# EAGLE schematic microelf (EAGLE 4.11)
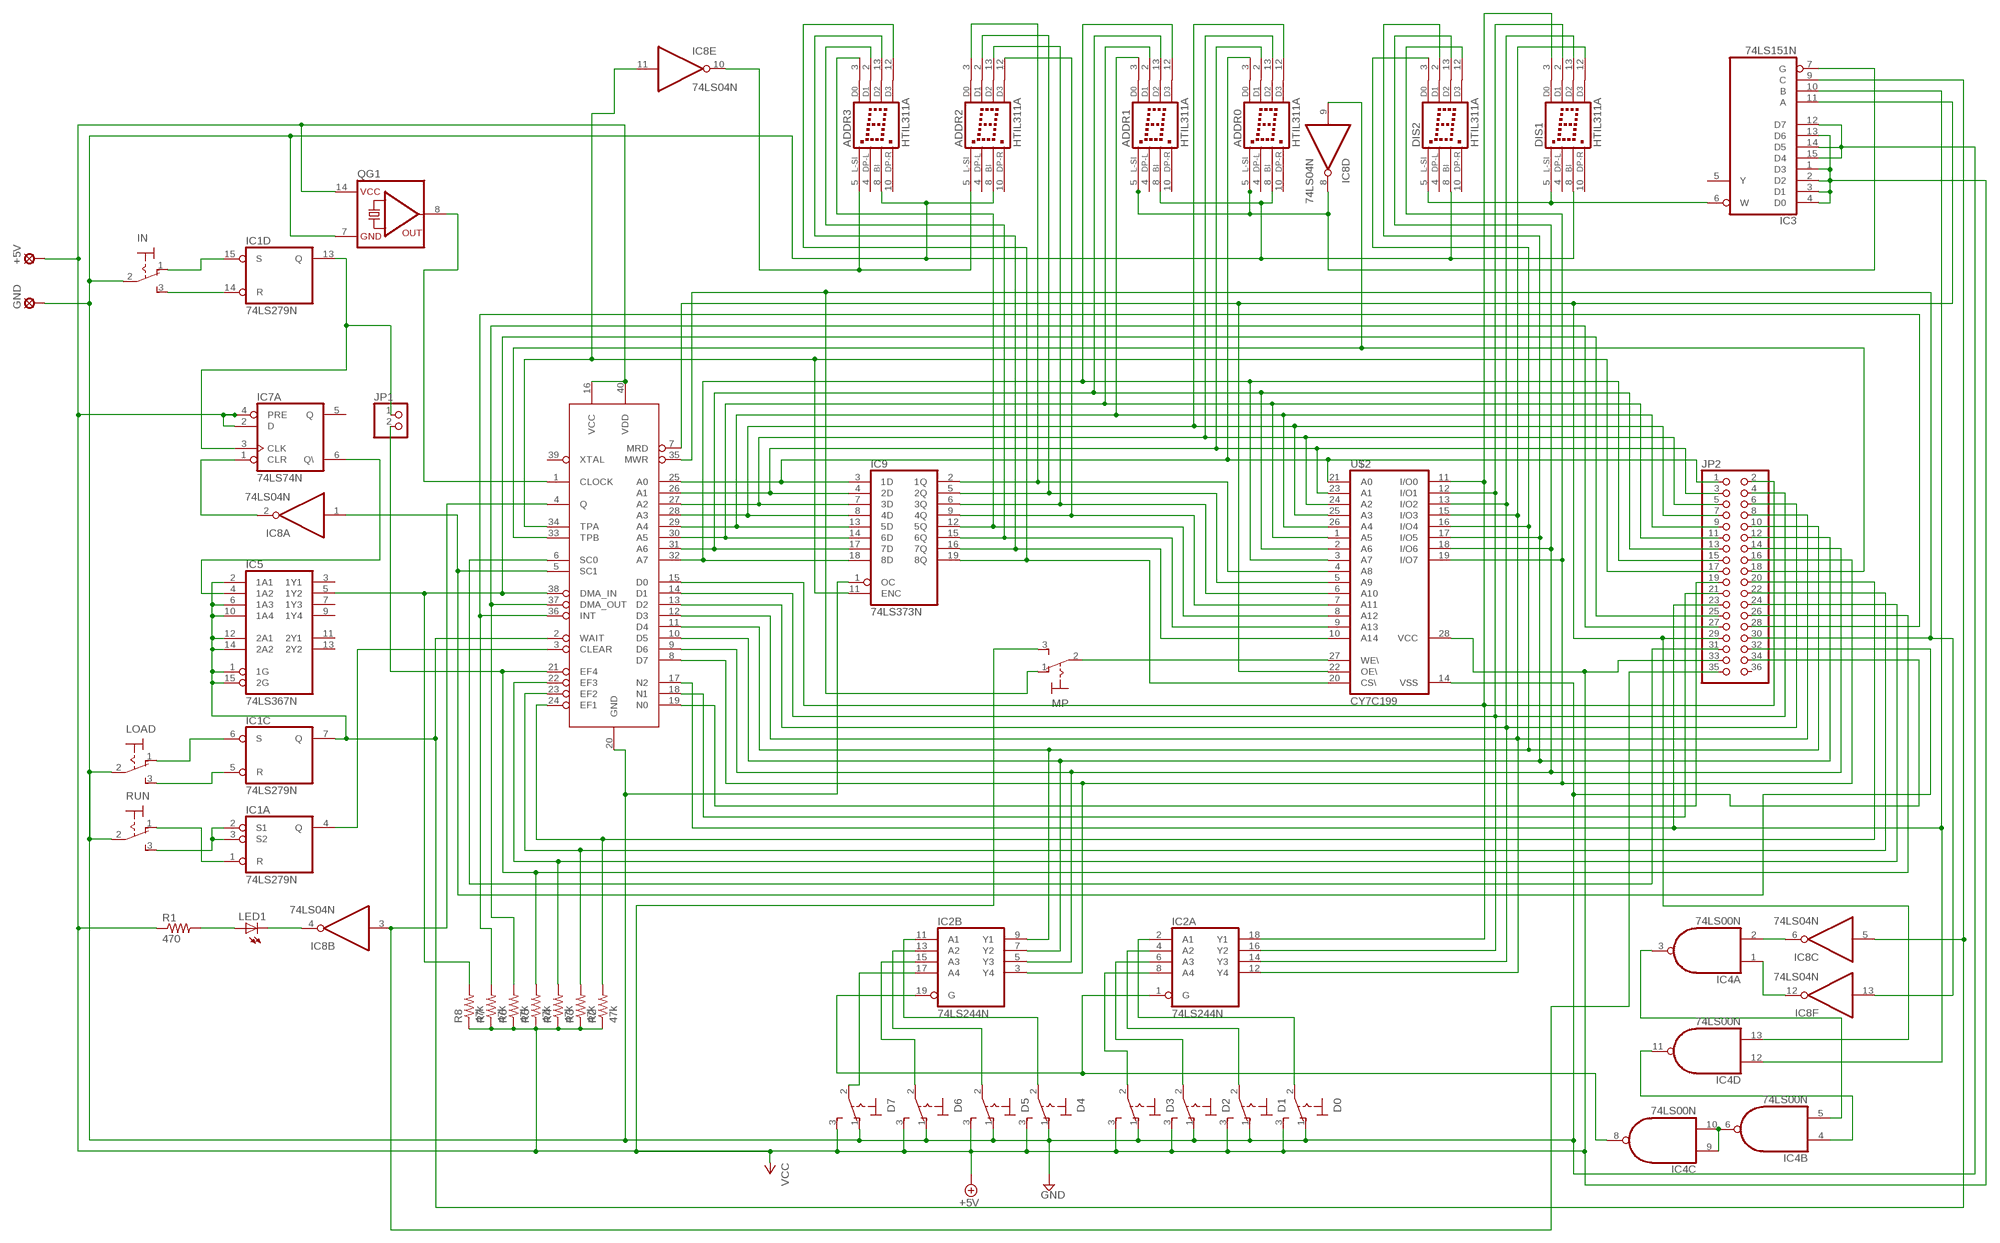
[diagram p0: schematic, sheet 1]

## Parts
+5V  SE14  [SE14]
ADDR0  HTIL311A  [HTIL311A]
ADDR1  HTIL311A  [HTIL311A]
ADDR2  HTIL311A  [HTIL311A]
ADDR3  HTIL311A  [HTIL311A]
D0  320-916  [320-916]
D1  320-916  [320-916]
D2  320-916  [320-916]
D3  320-916  [320-916]
D4  320-916  [320-916]
D5  320-916  [320-916]
D6  320-916  [320-916]
D7  320-916  [320-916]
DIS1  HTIL311A  [HTIL311A]
DIS2  HTIL311A  [HTIL311A]
GND  SE14  [SE14]
IC1  74LS279N  [DIL16]
IC2  74LS244N  [DIL20]
IC3  74LS151N  [DIL16]
IC4  74LS00N  [DIL14]
IC5  74LS367N  74367N  [DIL16]
IC6  CDP1802BCE  CDP1802BCECDP1802BCE  [DIL40]
IC7  74LS74N  [DIL14]
IC8  74LS04N  [DIL14]
IC9  74LS373N  [DIL20]
IN  320-916  [320-916]
JP1  PINHD-1X2  [1X02]
JP2  PINHD-2X18  [2X18]
LED1  LED5MM  [LED5MM]
LOAD  320-916  [320-916]
MP  320-916  [320-916]
QG1  QG5860  [DIL14S]
R1  470  R-US_0204/7  [0204/7]
R2  47k  R-US_0207/2V  [0207/2V]
R3  47k  R-US_0207/2V  [0207/2V]
R4  47k  R-US_0207/2V  [0207/2V]
R5  47k  R-US_0207/2V  [0207/2V]
R6  47k  R-US_0207/2V  [0207/2V]
R7  47k  R-US_0207/2V  [0207/2V]
R8  47k  R-US_0207/2V  [0207/2V]
RUN  320-916  [320-916]
U$2  CY7C199  [DIL28-3]

## Nets
!5: ADDR3.12(D3) IC9.19(8Q) U$2.20(CS\)
A0: ADDR0.3(D0) IC6.25(A0) IC9.3(1D) JP2.1 U$2.21(A0)
A1: ADDR0.2(D1) IC6.26(A1) IC9.4(2D) JP2.3 U$2.23(A1)
A2: ADDR0.13(D2) IC6.27(A2) IC9.7(3D) JP2.5 U$2.24(A2)
A3: ADDR0.12(D3) IC6.28(A3) IC9.8(4D) JP2.7 U$2.25(A3)
A4: ADDR1.3(D0) IC6.29(A4) IC9.13(5D) JP2.9 U$2.26(A4)
A5: ADDR1.2(D1) IC6.30(A5) IC9.14(6D) JP2.11 U$2.1(A5)
A6: ADDR1.13(D2) IC6.31(A6) IC9.17(7D) JP2.13 U$2.2(A6)
A7: ADDR1.12(D3) IC6.32(A7) IC9.18(8D) JP2.15 U$2.3(A7)
A8: ADDR2.3(D0) IC9.2(1Q) U$2.4(A8)
A9: ADDR2.2(D1) IC9.5(2Q) U$2.5(A9)
A10: ADDR2.13(D2) IC9.6(3Q) U$2.6(A10)
A11: ADDR2.12(D3) IC9.9(4Q) U$2.7(A11)
A12: ADDR3.3(D0) IC9.12(5Q) U$2.8(A12)
A13: ADDR3.2(D1) IC9.15(6Q) U$2.9(A13)
A14: ADDR3.13(D2) IC9.16(7Q) U$2.10(A14)
CLEAR: IC1.4(A:Q) IC6.3(CLEAR)
CLOCK: IC6.1(CLOCK) QG1.8(OUT)
D0: DIS1.3(D0) IC2.18(A:Y1) IC6.15(D0) JP2.2 U$2.11(I/O0)
D1: DIS1.2(D1) IC2.16(A:Y2) IC6.14(D1) JP2.4 U$2.12(I/O1)
D2: DIS1.13(D2) IC2.14(A:Y3) IC6.13(D2) JP2.6 U$2.13(I/O2)
D3: DIS1.12(D3) IC2.12(A:Y4) IC6.12(D3) JP2.8 U$2.15(I/O3)
D4: DIS2.3(D0) IC2.9(B:Y1) IC6.11(D4) JP2.10 U$2.16(I/O4)
D5: DIS2.2(D1) IC2.7(B:Y2) IC6.10(D5) JP2.12 U$2.17(I/O5)
D6: DIS2.13(D2) IC2.5(B:Y3) IC6.9(D6) JP2.14 U$2.18(I/O6)
D7: DIS2.12(D3) IC2.3(B:Y4) IC6.8(D7) JP2.16 U$2.19(I/O7)
DMA_IN: IC5.5(1Y2) IC6.38(DMA_IN) JP2.25 R8.2
DMA_OUT: IC6.37(DMA_OUT) JP2.27 R6.2
EF1: IC6.24(EF1) JP2.20 R2.2
EF2: IC6.23(EF2) JP2.22 R3.2
EF3: IC6.22(EF3) JP2.24 R4.2
EF4: IC6.21(EF4) JP1.2 JP2.26 R5.2
GND: ADDR0.8(BI) ADDR1.8(BI) ADDR2.8(BI) ADDR3.8(BI) D0.1(O) D1.1(O) D2.1(O) D3.1(O) D4.1(O) D5.1(O) D6.1(O) D7.1(O) DIS1.8(BI) DIS2.8(BI) GND.MP IC3.12(D7) IC3.14(D5) IC3.15(D4) IC6.20(GND) IC9.1(OC) IN.2(P) JP2.34 LOAD.2(P) QG1.7(GND) RUN.2(P) U$2.14(VSS)
INQ: IC1.13(D:Q) IC7.3(A:CLK) JP1.1
INT: IC6.36(INT) JP2.28 R7.2
MRD: IC3.11(A) IC4.13(D:I1) IC6.7(MRD) JP2.29 U$2.22(OE\)
MWR: IC6.35(MWR) IC8.13(F:I) JP2.30 MP.1(O)
N0: IC6.19(N0) JP2.19
N1: IC6.18(N1) JP2.21
N2: IC3.10(B) IC4.12(D:I0) IC6.17(N2) JP2.23
N$1: IC5.4(1A2) IC7.6(A:Q\)
N$2: IC1.14(D:R) IN.3(S)
N$9: IC4.6(B:O) IC4.9(C:I0) IC4.10(C:I1)
N$12: ADDR0.5(L-SI) ADDR1.5(L-SI) IC3.7(G) IC8.8(D:O)
N$13: IC4.2(A:I1) IC8.6(C:O)
N$14: ADDR2.5(L-SI) ADDR3.5(L-SI) IC8.10(E:O)
N$15: IC1.1(A:R) RUN.1(O)
N$16: IC1.2(A:S1) IC1.3(A:S2) RUN.3(S)
N$17: IC4.1(A:I0) IC8.12(F:O)
N$18: IC4.3(A:O) IC4.5(B:I1)
N$19: IC4.4(B:I0) IC4.11(D:O)
N$34: D0.2(P) IC2.2(A:A1)
N$35: D1.2(P) IC2.4(A:A2)
N$36: D2.2(P) IC2.6(A:A3)
N$37: D3.2(P) IC2.8(A:A4)
N$38: D4.2(P) IC2.11(B:A1)
N$39: D5.2(P) IC2.13(B:A2)
N$40: D6.2(P) IC2.15(B:A3)
N$41: D7.2(P) IC2.17(B:A4)
N$46: IC1.6(C:S) LOAD.1(O)
N$47: MP.2(P) U$2.27(WE\)
N$48: IC1.5(C:R) LOAD.3(S)
N$53: IC2.1(A:G) IC2.19(B:G) IC4.8(C:O)
N$54: DIS1.5(L-SI) DIS2.5(L-SI) IC3.6(W)
N$55: IC1.15(D:S) IN.1(O)
N$59: IC7.1(A:CLR) IC8.2(A:O)
N$64: IC8.4(B:O) LED1.K(C)
N$65: LED1.A R1.2
Q: IC6.4(Q) IC8.3(B:I) JP2.35
SC0: IC6.6(SC0) JP2.31
SC1: IC6.5(SC1) IC8.1(A:I) JP2.32
TPA: IC6.34(TPA) IC8.11(E:I) IC9.11(ENC) JP2.17
TPB: IC6.33(TPB) IC8.9(D:I) JP2.18
VCC: +5V.MP D0.3(S) D1.3(S) D2.3(S) D3.3(S) D4.3(S) D5.3(S) D6.3(S) D7.3(S) IC3.1(D3) IC3.2(D2) IC3.3(D1) IC3.4(D0) IC3.13(D6) IC6.16(VCC) IC6.40(VDD) IC7.2(A:D) IC7.4(A:PRE) JP2.33 MP.3(S) QG1.14(VCC) R1.1 R2.1 R3.1 R4.1 R5.1 R6.1 R7.1 R8.1 U$2.28(VCC) ; supply symbol labelled +5V
WAIT: IC1.7(C:Q) IC3.9(C) IC5.1(1G) IC5.2(1A1) IC5.6(1A3) IC5.10(1A4) IC5.12(2A1) IC5.14(2A2) IC5.15(2G) IC6.2(WAIT) IC8.5(C:I)
Unconnected: ADDR0.4(DP-L) ADDR0.10(DP-R) ADDR1.4(DP-L) ADDR1.10(DP-R) ADDR2.4(DP-L) ADDR2.10(DP-R) ADDR3.4(DP-L) ADDR3.10(DP-R) DIS1.4(DP-L) DIS1.10(DP-R) DIS2.4(DP-L) DIS2.10(DP-R) IC1.9(B:Q) IC1.10(B:R) IC1.11(B:S1) IC1.12(B:S2) IC3.5(Y) IC5.3(1Y1) IC5.7(1Y3) IC5.9(1Y4) IC5.11(2Y1) IC5.13(2Y2) IC6.39(XTAL) IC7.5(A:Q) IC7.8(B:Q\) IC7.9(B:Q) IC7.10(B:PRE) IC7.11(B:CLK) IC7.12(B:D) IC7.13(B:CLR) JP2.36

## Power pins joined to a net without a drawn wire
GND: ADDR0.7(GND) ADDR1.7(GND) ADDR2.7(GND) ADDR3.7(GND) DIS1.7(GND) DIS2.7(GND) IC1.8(P:GND) IC2.10(P:GND) IC3.8(GND) IC4.7(P:GND) IC5.8(GND) IC7.7(P:GND) IC8.7(P:GND) IC9.10(GND)
VCC: ADDR0.14(VCC) ADDR1.14(VCC) ADDR2.14(VCC) ADDR3.14(VCC) DIS1.14(VCC) DIS2.14(VCC) IC1.16(P:VCC) IC2.20(P:VCC) IC3.16(VCC) IC4.14(P:VCC) IC5.16(VCC) IC7.14(P:VCC) IC8.14(P:VCC) IC9.20(VCC)

## Library data of the parts
+5V GND = solpad:SE14: SOLDER PAD E1553, drill 1,4mm, distributor Buerklin, 07F820
ADDR0 ADDR1-ADDR3 DIS1 DIS2 = display-hp:HTIL311A: LED DISPLAY 1-character dot matrix, 2 decimal points
D0 D1-D7 IN LOAD MP RUN = switch:320-916: TOGGLE SWITCH distributor RS Components
IC1 = 74xx-us:74*279: Quadruple S-R LATCH
IC2 = 74xx-us:74*244: Octal BUFFER and LINE DRIVER, 3-state
IC3 = 74xx-us:74*151: Data SELECTOR/MULTIPLEXER
IC4 = 74xx-us:74*00: Quad 2-input NAND gate
IC5 = 74xx-us:74*367: Hex BUS DRIVER, 3-state
IC6 = cdp:CDP1802BCE
IC7 = 74xx-us:74*74: Dual D type positive edge triggered FLIP FLOP, preset and clear
IC8 = 74xx-us:74*04: Hex INVERTER
IC9 = 74xx-us:74*373: Octal D type transparent LATCH, edge triggered
JP1 = pinhead:PINHD-1X2: PIN HEADER
JP2 = pinhead:PINHD-2X18: PIN HEADER
LED1 = led:LED: LED OSRAM: - CHIPLED LG R971, LG N971, LY N971, LG Q971, LY Q971, LO R971, LY R971 LH N974, LH R974 LS Q976, LO Q976, LY Q976 LO Q996 - Hyper CHIPLED LW Q18S LB Q993, LB Q99A, LB R99A - SideLED LS A670, LO A670, LY A670, LG A670, LP A670 LB A673, LV A673, LT A673, LW A673 LH A674 LY A675 LS A676, LA A676, LO A676, LY A676, LW A676 LS A679, LY A679, LG A679 - Hyper Micro SIDELED® LS Y876, LA Y876, LO Y876, LY Y876 LT Y87S - SmartLED LW L88C, LW L88S LB L89C, LB L89S, LG L890 LS L89K, LO L89K, LY L89K LS L896, LA L896, LO L896, LY L896 - TOPLED LS T670, LO T670, LY T670, LG T670, LP T670 LSG T670, LSP T670, LSY T670, LOP T670, LYG T670 LG T671, LOG T671, LSG T671 LB T673, LV T673, LT T673, LW T673 LH T674 LS T676, LA T676, LO T676, LY T676, LB T676, LH T676, LSB T676, LW T676 LB T67C, LV T67C, LT T67C, LS T67K, LO T67K, LY T67K, LW E67C LS E67B, LA E67B, LO E67B, LY E67B, LB E67C, LV E67C, LT E67C LW T67C LS T679, LY T679, LG T679 LS T770, LO T770, LY T770, LG T770, LP T770 LB T773, LV T773, LT T773, LW T773 LH T774 LS E675, LA E675, LY E675, LS T675 LS T776, LA T776, LO T776, LY T776, LB T776 LHGB T686 LT T68C, LB T68C - Hyper Mini TOPLED® LB M676 - Mini TOPLED Santana® LG M470 LS M47K, LO M47K, LY M47K Source: http://www.osram.convergy.de/
QG1 = crystal:QG5860: CRYSTAL RESONATOR
R1-R8 = rcl:R-US_: RESISTOR, American symbol
U$2 = cdp:CY7C199